# Altium schematic sheet Flash.SchDoc
size A4; SheetNumber: 8; SheetTotal: 8
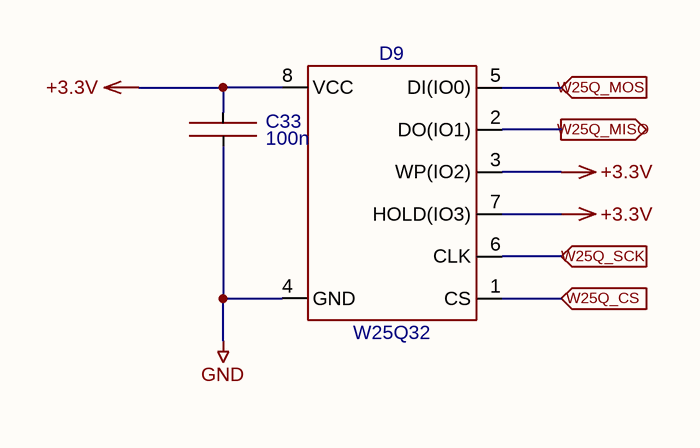
[diagram p0: Flash.SchDoc]

## Parts
C33  100n  [CAPC1608X09N]
D9  W25Q32  [WINBOND ST 8-Pin VSOP 208-mil]

## Ports
W25Q_CS (in), W25Q_MISO (out), W25Q_MOSI (in), W25Q_SCK (in)

## Nets
+3.3V: C33.2 D9.3(WP(IO2)) D9.7(HOLD(IO3)) D9.8(VCC)
GND: C33.1 D9.4(GND)
W25Q_CS: D9.1(CS) ; port W25Q_CS
W25Q_MISO: D9.2(DO(IO1)) ; port W25Q_MISO
W25Q_MOSI: D9.5(DI(IO0)) ; port W25Q_MOSI
W25Q_SCK: D9.6(CLK) ; port W25Q_SCK

## Library data of the parts
C33 = C0603-100n-25V-X7R-10%: GRM188R71E104KA01D
D9 = W25Q32BVSSIG